# EAGLE design bluesmirf (EAGLE 6.1)

## Sheet 1 of 3
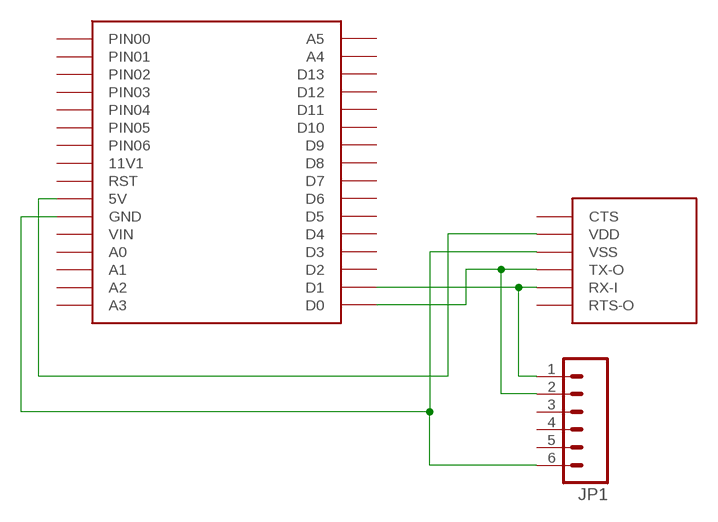
[diagram p0: schematic, sheet 1]

### Parts
JP1  M06LONGPADS  [1X06_LONGPADS]
U$1  BASE-FINAL  [BASE-FINAL]
U$2  BLUESMIRF  [BLUESMIRF]

### Nets
N$1: U$1.5V U$2.VDD
N$2: JP1.6 U$1.GND U$2.VSS
N$3: JP1.2 U$1.0(D0) U$2.TX-O
N$4: JP1.1 U$1.1(D1) U$2.RX-I
Unconnected: JP1.3 JP1.4 JP1.5 U$1.2(D2) U$1.3(D3) U$1.4(D4) U$1.5(D5) U$1.6(D6) U$1.7(D7) U$1.8(D8) U$1.9(D9) U$1.10(D10) U$1.11(D11) U$1.12(D12) U$1.12V(11V1) U$1.13(D13) U$1.A0 U$1.A1 U$1.A2 U$1.A3 U$1.A4 U$1.A5 U$1.PIN00 U$1.PIN01 U$1.PIN02 U$1.PIN03 U$1.PIN04 U$1.PIN05 U$1.PIN06 U$1.RST U$1.VIN U$2.CTS-I(CTS) U$2.RTS-O

## Sheet 2 of 3
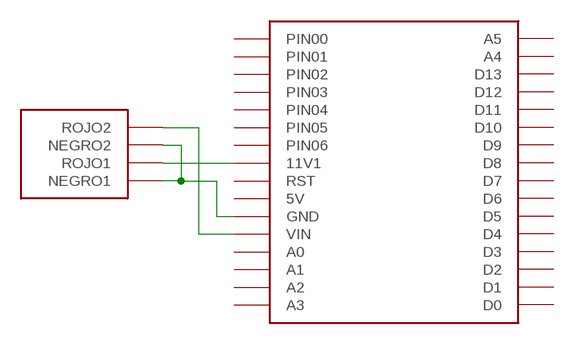
[diagram p1: schematic, sheet 2]

### Parts
U$3  BASE-FINAL  [BASE-FINAL]
U$4  CONECTOR_AUDIO  [CONECTOR_AUDIO]

### Nets
N$6: U$3.GND U$4.NEGRO1 U$4.NEGRO2
N$7: U$3.12V(11V1) U$4.ROJO1
N$8: U$3.VIN U$4.ROJO2
Unconnected: U$3.0(D0) U$3.1(D1) U$3.2(D2) U$3.3(D3) U$3.4(D4) U$3.5(D5) U$3.5V U$3.6(D6) U$3.7(D7) U$3.8(D8) U$3.9(D9) U$3.10(D10) U$3.11(D11) U$3.12(D12) U$3.13(D13) U$3.A0 U$3.A1 U$3.A2 U$3.A3 U$3.A4 U$3.A5 U$3.PIN00 U$3.PIN01 U$3.PIN02 U$3.PIN03 U$3.PIN04 U$3.PIN05 U$3.PIN06 U$3.RST

## Sheet 3 of 3
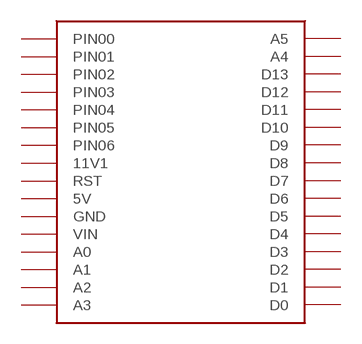
[diagram p2: schematic, sheet 3]

### Parts
U$7  BASE-FINAL  [BASE-FINAL]
Unconnected: U$7.0(D0) U$7.1(D1) U$7.2(D2) U$7.3(D3) U$7.4(D4) U$7.5(D5) U$7.5V U$7.6(D6) U$7.7(D7) U$7.8(D8) U$7.9(D9) U$7.10(D10) U$7.11(D11) U$7.12(D12) U$7.12V(11V1) U$7.13(D13) U$7.A0 U$7.A1 U$7.A2 U$7.A3 U$7.A4 U$7.A5 U$7.GND U$7.PIN00 U$7.PIN01 U$7.PIN02 U$7.PIN03 U$7.PIN04 U$7.PIN05 U$7.PIN06 U$7.RST U$7.VIN

## Library data of the parts
JP1 = SparkFun:M06: Header 6 Standard 6-pin 0.1" header. Use with straight break away headers (SKU : PRT-00116), right angle break away headers (PRT-00553), swiss pins (PRT-00743), machine pins (PRT-00117), and female headers (PRT-00115). Molex polarized connector foot print use with SKU : PRT-08094 with associated crimp pins and housings. NOTES ON THE VARIANTS LOCK and LOCK_LONGPADS... This footprint was designed to help hold the alignment of a through-hole component (i.e. 6-pin header) while soldering it into place. You may notice that each hole has been shifted either up or down by 0.005 of an inch from it's more standard position (which is a perfectly straight line). This slight alteration caused the pins (the squares in the middle) to touch the edges of the holes. Because they are alternating, it causes a "brace" to hold the component in place. 0.005 has proven to be the perfect amount of "off-center" position when using our standard breakaway headers. Although looks a little odd when you look at the bare footprint, once you have a header in there, the alteration is very hard to notice. Also, if you push a header all the way into place, it is covered up entirely on the bottom side. This idea of altering the position of holes to aid alignment will be further integrated into the Sparkfun Library for other footprints. It can help hold any component with 3 or more connection pins.
U$1 U$3 U$7 = aasanchez:BASE-FINAL
U$2 = aasanchez:BLUESMIRF
U$4 = aasanchez:CONECTOR_AUDIO

## Board
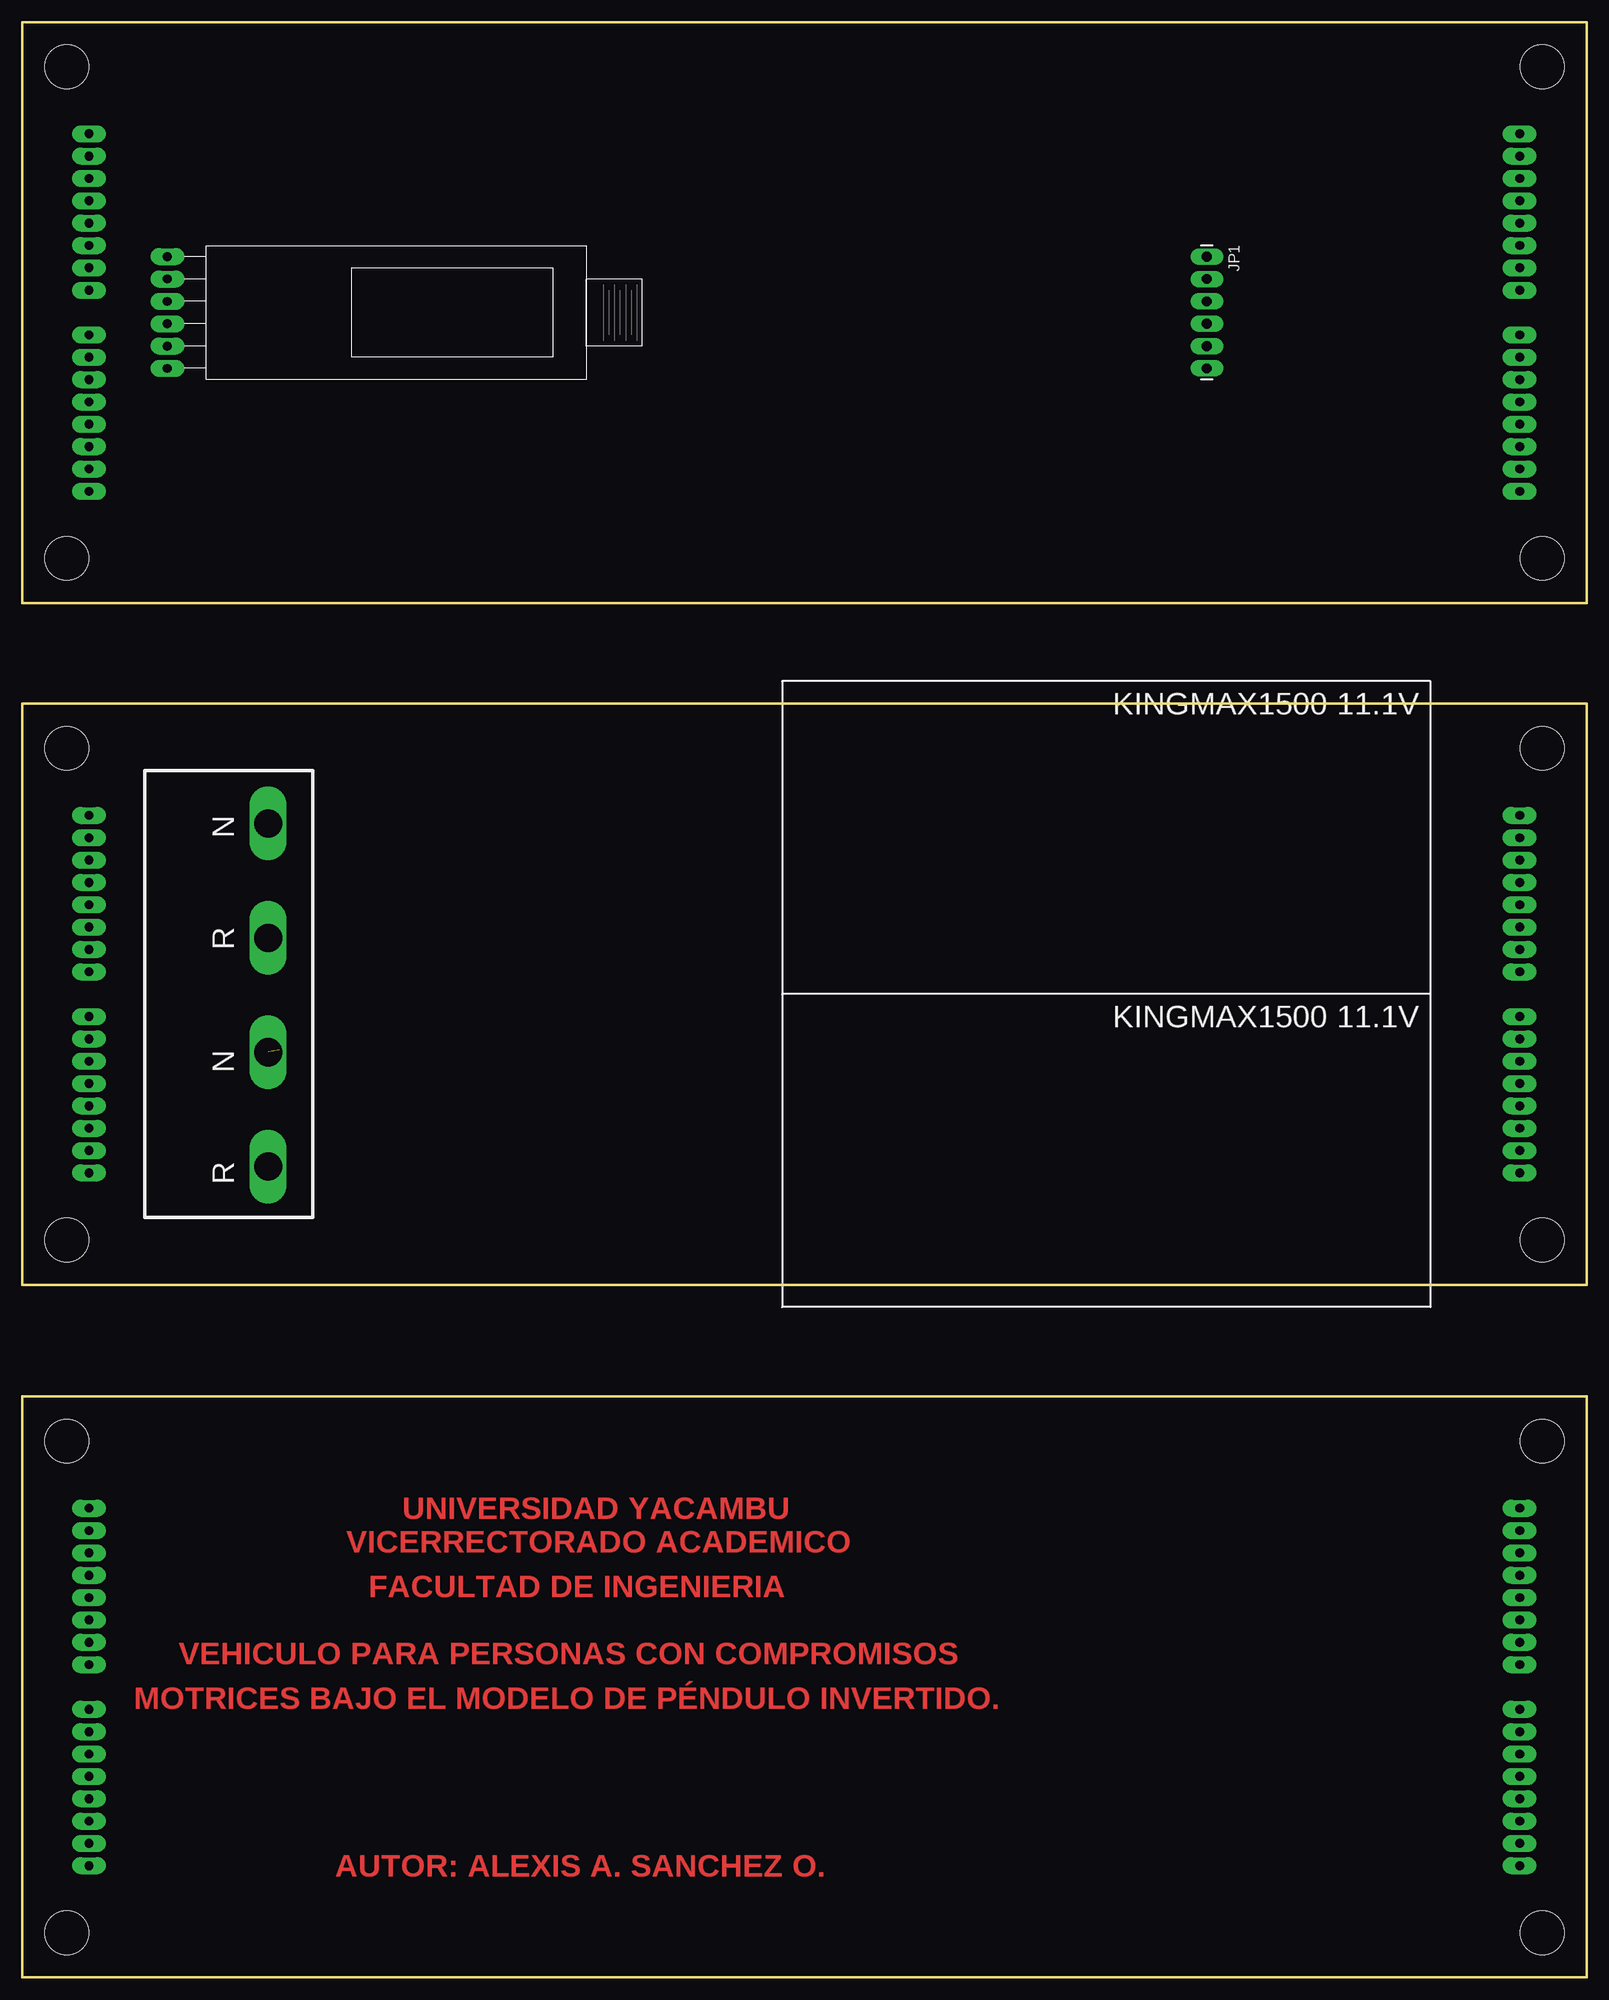
[diagram p3: board, top side]
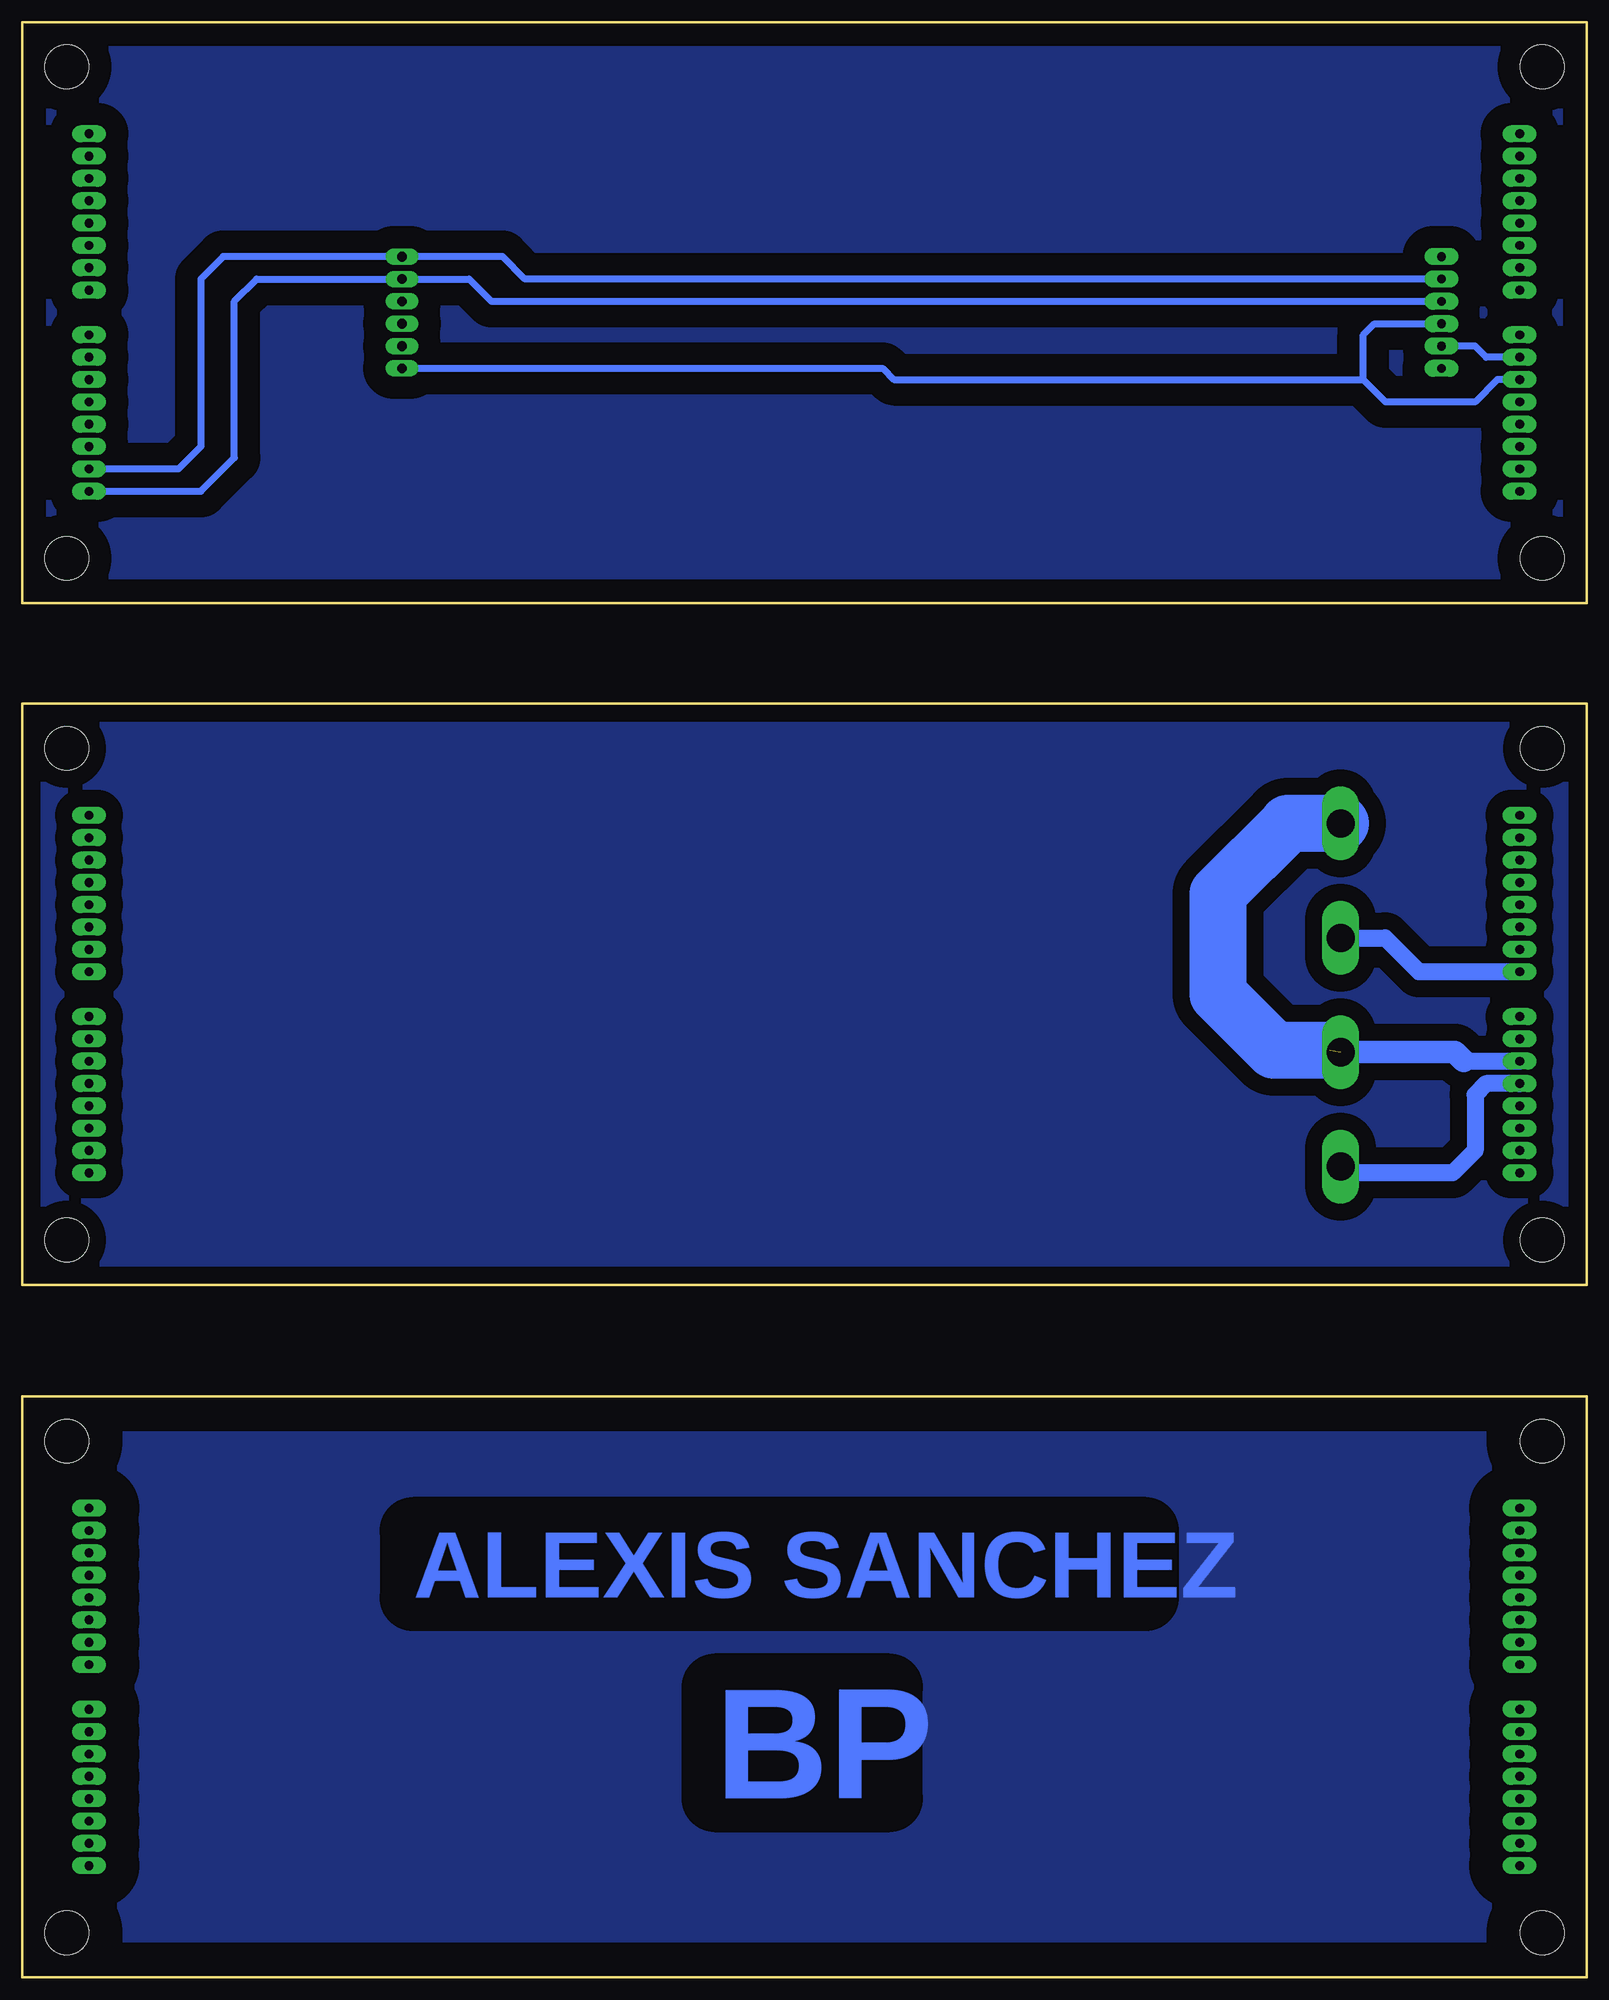
[diagram p4: board, bottom side, seen from below]

Size 177.8 x 222.25 mm. Coordinates in mm from the lower left corner, seen from the top.
Copper layers (1*16): Top 0.035mm / dielectric 1.5mm / Bottom 0.035mm
Design rules: minimum track width 10mil, minimum drill 24mil, track to track 8mil, track to pad 8mil, pad to pad 8mil, via to via 8mil, smd to smd 8mil, copper to edge 40mil, drill to drill 8mil, minimum pad ring 10mil, minimum via ring 8mil, stop-mask expansion 4mil, vias tented up to drill 0mil, thermal gap 10mil

### Footprints (pad centres in the part's own frame; a part is rotated, then mirrored left to right if it is on the bottom)
1X06_LONGPADS = drill 1.118 pad 1.88 long: 1 0,0; 2 2.54,0; 3 5.08,0; 4 7.62,0; 5 10.16,0; 6 12.7,0
BASE-FINAL = drill 1 pad 1.93 long: 0 81.28,-20.32; 1 81.28,-17.78; 2 81.28,-15.24; 3 81.28,-12.7; 4 81.28,-10.16; 5 81.28,-7.62; 5V -81.28,-5.08; 6 81.28,-5.08; 7 81.28,-2.54; 8 81.28,2.54; 9 81.28,5.08; 10 81.28,7.62; 11 81.28,10.16; 12 81.28,12.7; 12V -81.28,2.54; 13 81.28,15.24; A0 -81.28,-12.7; A1 -81.28,-15.24; A2 -81.28,-17.78; A3 -81.28,-20.32; A4 81.28,17.78; A5 81.28,20.32; GND -81.28,-7.62; PIN00 -81.28,20.32; PIN01 -81.28,17.78; PIN02 -81.28,15.24; PIN03 -81.28,12.7; PIN04 -81.28,10.16; PIN05 -81.28,7.62; PIN06 -81.28,5.08; RST -81.28,-2.54; VIN -81.28,-10.16 | hole 5: -83.82,27.94; -83.82,-27.94; 83.82,-27.94; 83.82,27.94
BLUESMIRF = drill 1 pad 1.93 long: CTS-I 0,0; RTS-O 0,12.7; RX-I 0,10.16; TX-O 0,7.62; VDD 0,2.54; VSS 0,5.08
CONECTOR_AUDIO = drill 3.2 long: NEGRO1 6,14; NEGRO2 32,14; ROJO1 19,14; ROJO2 45,14

### Placement (x,y rotation side)
JP1  134.62,195.58 270 top
U$1  88.9,189.23 0 top
U$2  16.51,182.88 0 top
U$3  88.9,111.76 0 top
U$4  13.97,137.16 270 top
U$5  [KINGMAX1500H]  123.19,93.98 90 top
U$6  [KINGMAX1500H]  123.19,129.54 90 top
U$7  88.9,33.02 0 top

### Tracks (layer width: path | path; a pad name or v marks a point on that pad's centre or on a via)
N$1
  Bottom 0.813: U$1.5V 11.43,184.15 12.7,185.42 U$2.VDD
N$2
  Bottom 0.813: 25.4,181.61 22.86,179.07 12.7,179.07 10.16,181.61 U$1.GND | 25.4,181.61 25.4,186.69 24.13,187.96 U$2.VSS | JP1.6 80.01,182.88 78.74,181.61 25.4,181.61
N$3
  Bottom 0.813: U$1.0 157.48,168.91 153.67,172.72 153.67,190.5 151.13,193.04 JP1.2 127,193.04 124.46,190.5 U$2.TX-O
N$4
  Bottom 0.813: U$2.RX-I 120.65,193.04 123.19,195.58 JP1.1 154.94,195.58 157.48,193.04 157.48,173.99 160.02,171.45 U$1.1
N$5
  pour Bottom (isolate 2.54): 0,156.21 177.8,156.21 177.8,220.98 177.8,222.25 0,222.25
N$6  (1 unrouted)
  Bottom 1.93: 13.97,104.14 U$3.GND
  Bottom 2.54: U$4.NEGRO2 14.99,105.16 13.97,104.14
  Bottom 6.452: U$4.NEGRO1 33.94,131.16 41.91,123.19 41.91,111.76 35.56,105.41 29.21,105.41
N$7
  Bottom 1.93: U$4.ROJO1 22.91,118.16 19.05,114.3 U$3.12V
N$8
  Bottom 1.93: U$3.VIN 11.43,101.6 12.7,100.33 12.7,93.98 15.24,91.44 27.25,91.44 U$4.ROJO2
N$9
  pour Bottom (isolate 1.93): 0,78.74 177.8,78.74 177.8,144.78 0,144.78
N$10
  pour Bottom (isolate 3.81): 0,0 177.8,0 177.8,66.04 0,66.04

### Text on the board
Top: UNIVERSIDAD YACAMBU | VICERRECTORADO ACADEMICO | FACULTAD DE INGENIERIA | VEHICULO PARA PERSONAS CON COMPROMISOS | MOTRICES BAJO EL MODELO DE PÉNDULO INVERTIDO. | AUTOR: ALEXIS A. SANCHEZ O.
Bottom: ALEXIS SANCHEZ | BP
Drill_legend: ARTE NUEVO | ARTE NUEVO